# EasyEDA Pro project ESP32-C3-PICO开发板.eprj, board PCB1_10
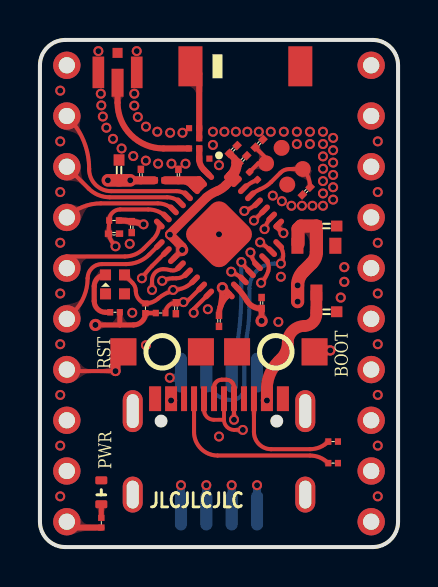
[diagram p6: board, top side]
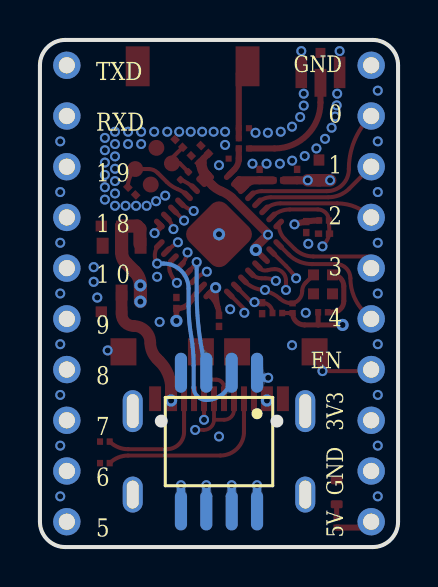
[diagram p7: board, bottom side, seen from below]

Outline 17.93 x 25.4 mm; copper layers: Top Layer, Inner1, Inner2, Bottom Layer. Coordinates in mm from the lower left corner of the outline.
Outline path: 0,24.13 0,1.27 arc(0.37,0.37) 1.27,0 16.66,0 arc(17.56,0.37) 17.93,1.27 17.93,24.13 arc(17.56,25.03) 16.66,25.4 1.27,25.4 arc(0.37,25.03) 0,24.13
Stack: Top Layer 0.035mm 外层铜厚1oz / Dielectric1 0.28mm 7628 RC49% 8.6mil / Inner1 0.035mm 内层铜厚 / Dielectric2 0.28mm 1.1mm H/HOZ 含铜 / Inner2 0.035mm 内层铜厚 / Dielectric3 0.28mm 7628 RC49% 8.6mil / Bottom Layer 0.035mm 外层铜厚1oz

## Design rules (mm)
template: 自定义配置
spacing copperThickness1oz (default): track to track 0.102, other pairs 0.152 to 0.3
spacing copperThickness2oz: track to track 0.203, other pairs 0.152 to 0.3
track width copperThickness1oz (default): min 0.127, default 0.254, max 2.54
track width copperThickness2oz: min 0.203, default 0.254, max 2.54
differential pair differentialPair (default): width min 0.127, default 0.254, max 2.54; gap min 0.152, default 0.152
via viaSize (default): diameter min 0.5, default 0.61, max 10; hole min 0.3, default 0.305, max 6.299
pour e54 uses 顶层铺铜

## Placement (name value [footprint] x y rotation side)
ANT1  CrossAir CA-C03  [ant-smd_ca-c03]  10.29 24.08 0 top
C1  15pF  [C0201]  13.34 17.83 45 top
C2  15pF  [C0201]  10.97 20.22 45 top
C6  100nF  [C0201]  6.93 18.64 90 top
C8  100nF  [C0201]  5.05 18.64 90 top
C9  100nF  [C0201]  8.97 11.33 90 top
C11  100nF  [C0201]  4.6 16.03 270 top
C15  1uF  [C0402MINI]  14.35 16.08 180 top
C16  1uF  [C0402MINI]  14.35 11.79 180 top
C21  1uF  [C0201]  11.1 12.22 90 top
C22  10uF  [C0402MINI]  3.96 18.88 270 top
C24  100nF  [C0201]  6.81 11.96 90 top
C28  1uF  [C0201]  9.68 19.91 225 top
C29  10nF  [C0201]  10.16 19.41 45 top
C30  100nF  [C0201]  3.71 15.7 0 top
H7  X6511WV-10H-C30D60  [HDR-TH_10P-P2.54-V-M]  1.35 12.7 90 top
H8  X6511WV-10H-C30D60  [HDR-TH_10P-P2.54-V-M]  16.59 12.7 90 top
L1  3nH  [l0201]  7.72 20.98 180 top
L2  24nH  [l0201#2]  10.69 18.59 135 top
L3  2nH  [l0201-rd]  5.99 18.37 0 top
LED1  NCD0402R1  [LED0402MINI]  3.07 2.74 270 top
LED6  SK6805-EC15  [led-smd_4p-l1.5-w1.5-bl]  3.76 13.16 180 top
R2  NC  [r0201]  7.72 19.96 180 top
R3  10kΩ  [R0201]  5.28 11.96 270 top
R4  5.1kΩ  [R0201]  14.68 4.2 180 top
R5  5.1kΩ  [R0201]  14.68 5.28 180 top
R7  10kΩ  [R0201]  3.71 16.36 0 top
R8  5.1kΩ  [R0201]  3.07 1.22 270 top
R11  NC  [r0201]  8.23 19.46 0 top
R12  0Ω  [r0201]  7.98 20.22 90 top
R13  0Ω  [R0201]  3.76 11.76 0 top
R14  10kΩ  [R0201]  6.05 11.72 180 top
RF1  KH-IPEX4-2020  [ipex4-smd_4p-l1.8-w1.7-ls2.0-l_kh-ipex4-2020]  3.89 24 90 top
SW1  TS-1185-C-B-B-A  [sw-smd_l4.0-w2.9-ls5.0]  6.12 9.78 0 top
SW2  TS-1185-C-B-B-A  [sw-smd_l4.0-w2.9-ls5.0]  11.81 9.78 180 top
U1  ESP32-C3FH4  [QFN-32_L5.0-W5.0-P0.50-TL-EP3.7]  8.97 15.67 315 top
U2  ME6211A33M3G-N  [sot-23-3_l2.9-w1.6-p1.90-ls2.8-br]  13.84 13.92 90 top
U4  GT-USB-7010ASV  [usb-c-smd_g-switch_gt-usb-7010asv]  8.97 5.03 0 top
U5  GD25Q128ESIGR  [SOP-8_L5.3-W5.3-P1.27-LS8.0-BL]  8.97 5.28 0 bottom
X1  40MHz  [crystal-smd_4p-l2.0-w1.6-bl]  12.24 19.08 315 top

## Footprints (pads in the part's own frame, mm; a bottom-side part is the same pattern mirrored in y, then rotated)
ant-smd_ca-c03
  rect 1.2x2 smd: 1(-2.75,0) 2(2.75,0)
C0201
  rect 0.368x0.324 smd: 1(-0.275,0) 2(0.275,0)
C0402MINI
  rect 0.567x0.54 smd: 1(-0.508,0) 2(0.508,0)
crystal-smd_4p-l2.0-w1.6-bl
  rrect 0.8x0.8 smd: 1(-0.75,-0.55) 2(0.75,-0.55) 3(0.75,0.55) 4(-0.75,0.55)
HDR-TH_10P-P2.54-V-M
  round 1.371 hole 0.813: 1(-11.43,0) 2(-8.89,0) 3(-6.35,0) 4(-3.81,0) 5(-1.27,0) 6(1.27,0) 7(3.81,0) 8(6.35,0) 9(8.89,0) 10(11.43,0)
ipex4-smd_4p-l1.8-w1.7-ls2.0-l_kh-ipex4-2020
  rect 1.4x0.6 smd: 1(-0.748,0)
  rect 1.58x0.58 smd: 2(-0.228,-0.96) 4(-0.228,0.96)
  rect 0.5x0.5 smd: 3(0.748,0)
l0201
  rect 0.305x0.305 smd: 1(-0.254,0) 2(0.254,0)
l0201#2
  rrect 0.305x0.324 smd: 1(-0.275,0) 2(0.275,0)
l0201-rd
  rect 0.368x0.324 smd: 1(-0.275,0) 2(0.275,0)
LED0402MINI
  rrect 0.4x0.6 smd: 1(-0.6,0) 2(0.6,0)
led-smd_4p-l1.5-w1.5-bl
  rect 0.55x0.55 smd: 1(-0.475,-0.475) 2(0.475,-0.475) 3(0.475,0.475) 4(-0.475,0.475)
QFN-32_L5.0-W5.0-P0.50-TL-EP3.7
  rrect 0.65x0.28 smd: 1(-2.478,1.75) 2(-2.478,1.25) 3(-2.478,0.75) 4(-2.478,0.25) 5(-2.478,-0.25) 6(-2.478,-0.75) 7(-2.478,-1.25) 8(-2.478,-1.75) 17(2.478,-1.75) 18(2.478,-1.25) 19(2.478,-0.75) 20(2.478,-0.25) 21(2.478,0.25) 22(2.478,0.75) 23(2.478,1.25) 24(2.478,1.75)
  rrect 0.28x0.65 smd: 9(-1.75,-2.478) 10(-1.25,-2.478) 11(-0.75,-2.478) 12(-0.25,-2.478) 13(0.25,-2.478) 14(0.75,-2.478) 15(1.25,-2.478) 16(1.75,-2.478) 25(1.75,2.478) 26(1.25,2.478) 27(0.75,2.478) 28(0.25,2.478) 29(-0.25,2.478) 30(-0.75,2.478) 31(-1.25,2.478) 32(-1.75,2.478)
  rrect 2.642x2.642 smd: 33(0,0)
r0201
  rect 0.305x0.305 smd: 1(-0.254,0) 2(0.254,0)
R0201
  rect 0.303x0.324 smd: 1(-0.241,0) 2(0.241,0)
SOP-8_L5.3-W5.3-P1.27-LS8.0-BL
  oval 0.609x2 smd: 1(-1.905,-3.45) 2(-0.635,-3.45) 3(0.635,-3.45) 4(1.905,-3.45) 5(1.905,3.45) 6(0.635,3.45) 7(-0.635,3.45) 8(-1.905,3.45)
sot-23-3_l2.9-w1.6-p1.90-ls2.8-br
  rect 0.8x0.6 smd: 1(1.172,-0.95) 2(1.171,0.95) 3(-1.171,0)
sw-smd_l4.0-w2.9-ls5.0
  rect 1.3x1.36 smd: 1(-1.94,0) 2(1.94,0)
usb-c-smd_g-switch_gt-usb-7010asv
  oval 1x2.1 hole 0.6x1.7: 1(-4.32,1.78) 2(4.32,1.78)
  oval 1x1.8 hole 0.6x1.4: 3(4.32,-2.4) 4(-4.32,-2.4)
  rect 0.6x1.24 smd: A1B12(-3.2,2.4) A4B9(-2.4,2.4) B1A12(3.2,2.4) B4A9(2.4,2.4)
  rect 0.3x1.24 smd: A5(-1.25,2.4) A6(-0.25,2.4) A7(0.25,2.4) A8(1.25,2.4) B5(1.75,2.4) B6(0.75,2.4) B7(-0.75,2.4) B8(-1.75,2.4)

## Nets
As in the schematic.

Pads without a net: ANT1 2; LED6 3; U4 A8 B8

## Via types
v1: diameter 0.559, hole 0.305, Top Layer to Bottom Layer, 1 via
v2: diameter 0.5, hole 0.299, Top Layer to Bottom Layer, 97 vias
v3: diameter 0.61, hole 0.305, Top Layer to Bottom Layer, 8 vias
v4: diameter 0.5, hole 0.3, Top Layer to Bottom Layer, 8 vias
v5: diameter 0.508, hole 0.299, Top Layer to Bottom Layer, 3 vias

## Routing (per net, layer and track width the routed paths; a pad name or vN(x,y) marks a point on that pad's centre or on a via; arc(x,y) is an arc through that point)
GND:
  vias: v2(1.02,22.86) v2(1.02,20.32) v2(1.02,17.78) v2(1.02,15.24) v2(1.02,12.7) v2(1.02,10.16) v2(1.02,7.62) v2(1.02,5.08) v2(1.02,2.54) v2(2.93,24.84) v2(3.05,22.71) v2(3.07,22.12) v2(3.15,21.56) v2(3.33,21) v2(3.66,20.45) v2(4.09,19.96) v2(4.5,15.19) v2(4.67,19.58) v2(4.62,11.73) v2(4.72,22.71) v2(4.72,22.11) v2(4.85,24.84) v2(4.9,21.54) v2(5.31,21.06) v2(5.3,19.35) v2(5.31,10.11) v2(5.88,20.8) v2(6.52,20.75) v2(6.58,19.2) v2(7.14,20.75) v2(7.29,19.2) v2(8.41,11.91) v2(8.66,20.14) v2(8.97,19.13) v2(8.97,5.54) v2(9.24,20.8) v2(10.38,20.8) v2(10.96,20.8) v2(11.56,20.8) v2(11.66,17.6) v2(11.94,11.28) v2(12.06,13.54) v2(12.21,20.8) v2(12.59,17.09) v2(12.87,20.8) v2(12.87,20.19) v2(13.12,17.09) v2(13.52,20.8) v2(13.52,20.19) v2(13.65,17.09) v2(14.17,20.8) v2(14.17,20.18) v2(14.17,19.57) v2(14.17,18.95) v2(14.17,18.33) v2(14.17,17.71) v2(14.17,17.09) v2(14.68,20.49) v2(14.68,19.88) v2(14.68,19.26) v2(14.68,18.64) v2(14.68,18.02) v2(14.68,17.4) v2(16.92,20.32) v2(16.92,17.78) v2(16.92,15.24) v2(16.92,12.7) v2(16.92,10.16) v2(16.92,7.62) v2(16.92,5.08) v2(16.92,2.54) v3(8.97,15.67) v4(5.92,19.2) v4(8.66,20.8) v4(9.81,20.8) v4(12.12,17.32) v5(15.06,12.5) v5(15.24,14.02) v5(15.24,13.28)
VBUS: length 23.4
  Top Layer w0.302: 1.35,1.27 1.64,0.98 R8.2
  Top Layer w0.584: 11.37,7.33 11.37,7.92 arc(11.51,8.66) 11.94,9.3 12.08,9.43 arc(12.32,9.8) 12.41,10.24 arc(12.65,10.83) 13.25,11.07 arc(13.67,11.25) 13.84,11.67 C16.2 U2.3
  Inner1 w1.016: 7.39,7.34 v3(11.37,7.34) ; 7.39,7.34 v3(6.57,7.34) ; 7.39,7.34 7.39,5.82 arc(7.04,4.99) 6.21,4.64 4.44,4.64 arc(3.55,4.27) 3.18,3.38 arc(2.65,1.98) 1.35,1.27
VDD_3V3: length 56.8
  Top Layer w0.203: R3.2 arc(5.54,11.72) R14.2
  Top Layer w0.254: R13.2 4,11.12 ; 4,11.12 4.69,11.12 arc(5.11,11.3) R3.2 ; 4,11.12 v3(2.78,11.12)
  Top Layer w0.28: 9.73,19.48 9.73,19.25 arc(9.66,18.93) U1.32 ; U1.11 v3(7.12,14.88) ; U1.32 9.91,19.08 ; U1.32 9.68,18.66 ; 9.91,19.08 9.96,19.14 ; 9.91,19.08 arc(9.76,18.89) 9.68,18.66 ; 9.68,18.66 9.73,18.66 9.78,18.61 ; 9.96,19.14 9.97,19.14 C29.1 arc(9.97,19.17) 9.96,19.14 ; 9.96,19.14 arc(9.9,18.86) 9.78,18.61 ; 9.78,18.61 9.95,18.44 ; 9.04,12.04 arc(8.98,11.82) C9.2 ; 9.04,12.04 arc(9.17,12.32) 9.36,12.56 U1.17 v1(9.13,12.99) arc(9.11,12.51) 9.04,12.04
  Top Layer w0.305: R7.2 arc(4.28,16.34) 4.6,16.31 arc(4.9,16.25) v2(5.19,16.16)
  Top Layer w0.33: C29.1 9.97,19.24 9.73,19.48 C28.2
  Top Layer w0.406: v2(4.52,18.37) C8.1 L3.1
  Top Layer w0.457: 9.66,18.48 9.3,18.12 arc(9.09,17.95) 8.86,17.83 arc(8.58,17.69) 8.33,17.51 6.51,15.68 v2(6.51,15.65) 7.12,15.03 v3(7.12,14.88)
  Top Layer w0.635: v2(3.4,18.37) C22.2 v2(4.52,18.37)
  Top Layer w0.66: 12.92,15.18 12.92,15.94 13.07,16.08 C15.2 13.84,14.78 arc(13.78,14.48) 13.61,14.22 13.19,13.8 arc(12.98,13.48) v3(12.9,13.11) v3(12.9,12.29)
  Inner1 w1.016: 2.78,17.39 2.78,17.74 arc(2.96,18.19) v2(3.4,18.37) v2(4.52,18.37) ; 2.78,17.39 2.78,14.93 ; 2.78,17.39 arc(3.14,16.52) 4.01,16.16 ; 2.78,14.93 v3(2.78,11.12) 2.78,7.78 1.35,6.35 ; 2.78,14.93 arc(3.14,15.8) 4.01,16.16 ; 11.44,12.3 v3(12.9,12.29) v3(12.9,13.11) arc(12.28,12.51) 11.44,12.3 ; 11.44,12.3 arc(10.62,12.38) 9.84,12.62 arc(9.48,12.79) v1(9.13,12.99) arc(8.79,13.24) 8.48,13.53 v3(7.12,14.88) 6.3,15.7 arc(5.79,16.04) v2(5.19,16.16) 4.01,16.16
VDD_SPI: length 20.6
  Top Layer w0.28: v3(11.1,11.33) C21.1 arc(10.68,12.04) 10.36,12.34 arc(10.12,12.7) 9.83,13.03
  Inner2 w0.406: v2(7.06,3.1) arc(8.02,2.46) 9.15,2.23 10.87,2.23 arc(11.48,2.49) 11.73,3.1 arc(11.48,3.71) 10.87,3.96 arc(10.39,4.01) 9.93,4.17 arc(9.46,4.34) 8.97,4.44 arc(8.46,4.72) 8.25,5.26 8.25,6.75 arc(8.41,7.51) 8.84,8.15 10.45,9.77 arc(10.93,10.48) v3(11.1,11.33)
  Bottom Layer w0.406: v2(7.06,3.1) U5.8
CHIP_EN: length 14.5
  Top Layer w0.203: H7.4 1.42,8.81 v4(3.78,8.81) ; v4(3.78,15.06) arc(3.56,15.35) C30.1 R7.1 arc(3.63,16.75) 4.02,16.91 5.42,16.91 arc(5.91,16.81) U1.7
  Top Layer w0.5: v4(3.78,8.81) 3.78,9.38 SW1.1
  Inner1 w0.254: 3.68,15.06 3.68,8.81
GPIO0: length 8.6
  Top Layer w0.203: H7.9 1.39,21.55 arc(2.18,20.36) 2.46,18.95 2.46,18.92 arc(2.78,18.15) 3.56,17.83 6.83,17.83 arc(7.13,17.77) U1.4
GPIO1: length 6.3
  Top Layer w0.203: H7.8 2.44,17.96 arc(2.92,17.63) 3.49,17.52 6.37,17.52 arc(6.73,17.45) U1.5
GPIO2: length 5.6
  Top Layer w0.203: 1.35,16.51 arc(2.13,17.03) 3.05,17.21 5.89,17.21 arc(6.32,17.13) U1.6
GPIO3: length 6
  Top Layer w0.203: H7.6 1.35,14.55 4.24,14.55 arc(4.76,14.66) 5.19,14.95 5.66,15.41 arc(5.89,15.76) U1.8
GPIO4: length 6.7
  Top Layer w0.203: U1.9 5.48,14.65 arc(4.95,14.3) 4.32,14.17 3.1,14.17 arc(2.6,13.96) 2.39,13.46 arc(2.21,12.55) 1.69,11.77 1.35,11.43
GPIO5: length 21.7
  Top Layer w0.203: 6.33,14.8 5.62,14.08 arc(5.35,13.78) v2(5.11,13.46)
  Inner1 w0.203: v2(5.11,13.46) 5.11,12.7 arc(6.38,9.61) 9.47,8.33 13.08,8.33 arc(14.57,7.71) 15.19,6.22 arc(15.22,5.6) 15.32,4.98 arc(15.41,4.4) 15.44,3.82 arc(15.74,2.43) 16.59,1.27
GPIO6: length 18.9
  Top Layer w0.203: v2(5.61,12.88) 5.61,13.36 arc(5.78,13.76) 6.17,13.92 arc(6.35,13.91) 6.53,13.87 arc(6.82,13.89) U1.12
  Inner1 w0.203: H8.2 16.43,3.97 arc(15.74,5) 15.49,6.22 arc(14.79,7.93) 13.08,8.64 9.5,8.64 arc(6.75,9.77) 5.61,12.52 v2(5.61,12.88)
GPIO7: length 15.9
  Top Layer w0.203: U1.13 7.32,13.66 arc(7.09,13.51) 6.83,13.46 6.65,13.46 arc(6.38,13.43) v2(6.12,13.33)
  Inner1 w0.203: 16.59,6.35 16.59,6.55 15.12,8.02 arc(14.2,8.7) 13.08,8.94 9.5,8.94 arc(7.11,9.93) 6.12,12.32 v2(6.12,13.33)
GPIO8: length 17.1
  Top Layer w0.203: LED6.1 4.63,13.23 arc(4.76,13.05) 4.8,12.83 arc(4.94,12.43) R3.1 arc(5.62,12.27) 5.92,12.45 arc(6.27,12.68) 6.67,12.83 ; v2(6.67,12.88) arc(7.26,13.01) U1.14
  Inner1 w0.203: 6.67,12.83 6.67,12.08 arc(7.5,10.08) 9.5,9.25 16.23,9.25 H8.4
GPIO9/BOOT: length 15.1
  Top Layer w0.203: v2(7.19,12.27) 7.34,12.27 8.1,13.03 ; R14.1 arc(6.44,12.09) 6.8,12.24
  Top Layer w0.305: v2(7.19,12.27) C24.2
  Top Layer w0.5: v2(14.54,9.85) 13.82,9.85 SW2.1
  Inner1 w0.203: 16.59,11.43 16.12,11.43 v2(14.54,9.85) arc(14.21,9.63) 13.82,9.55 9.49,9.55 arc(7.86,10.22) 7.19,11.85 v2(7.19,12.27)
GPIO10: length 13.4
  Top Layer w0.203: U1.16 7.7,11.92 v2(7.7,11.73)
  Inner1 w0.203: H8.6 arc(15.63,12.12) 14.4,10.44 arc(13.83,10.01) 13.13,9.85 9.58,9.85 arc(8.25,10.41) v2(7.7,11.73)
GPIO18/USB_DN: length 22.5
  Top Layer w0.191: U4.B7 8.22,6.86 arc(8.36,6.52) 8.7,6.38 9.22,6.38 ; 9.22,6.38 U4.A7 ; 9.22,6.38 arc(9.36,6.02) 9.72,5.87 v2(10.16,5.87)
  Top Layer w0.28: v2(12.19,15.72) 11.84,16.07 U1.25
  Inner1 w0.203: 16.59,16.51 15.75,15.67 arc(15.27,15.35) 14.71,15.24 13.36,15.24 arc(12.73,15.37) v2(12.19,15.72)
  Inner2 w0.203: v2(12.19,15.72) 13.44,14.48 arc(13.87,13.83) 14.02,13.07 14.02,10.45 arc(13.37,8.87) 11.79,8.21 11.75,8.21 arc(10.71,7.79) 10.29,6.76 10.29,5.99 v2(10.16,5.87)
GPIO19/USB_DP: length 24.9
  Top Layer w0.203: U4.A6 8.72,8 arc(8.83,8.27) 9.1,8.38 9.34,8.38 arc(9.6,8.27) 9.72,8 U4.B6 v2(9.72,6.38) ; U1.26 arc(11.38,16.25) v2(11.25,15.92)
  Inner1 w0.203: H8.8 16.38,18.85 arc(15.71,17.83) 15.47,16.64 arc(15.17,15.92) 14.45,15.62 13.54,15.62 arc(13.12,15.73) 12.78,16 arc(12.62,16.14) 12.42,16.23 arc(11.79,16.24) v2(11.25,15.92)
  Inner2 w0.203: v2(11.25,15.92) 13.22,13.95 arc(13.59,13.4) 13.72,12.75 13.72,10.52 arc(13.14,9.11) 11.73,8.53 arc(11.08,8.4) 10.52,8.03 10.32,7.83 arc(9.87,7.16) v2(9.72,6.38)
GPIO20/U0RXD: length 11
  Top Layer w0.203: v4(10.72,16.35) U1.27
  Inner2 w0.203: v4(10.72,16.35) 10.79,16.43 11.2,16.43 arc(11.82,16.37) 12.42,16.18 arc(12.96,15.98) 13.52,15.9 14.1,15.9 arc(15.12,16.32) 15.54,17.35 15.54,19.08 arc(15.82,20.44) H8.9
GPIO21/U0TXD: length 13.6
  Top Layer w0.203: U1.28 arc(10.59,17) v4(10.23,16.83)
  Inner2 w0.203: v4(10.23,16.83) 10.27,16.87 10.74,16.87 arc(11.67,16.77) 12.55,16.48 arc(13.04,16.29) 13.56,16.2 13.97,16.2 arc(14.87,16.58) 15.24,17.47 15.24,19.35 arc(15.28,19.82) 15.39,20.27 arc(15.51,20.81) 15.54,21.36 15.54,21.62 arc(15.82,22.98) H8.10
SPICLK: length 15.3
  Top Layer w0.203: v2(11.07,13.23) arc(11.29,13.5) 11.43,13.82 arc(11.43,14.16) U1.22
  Inner2 w0.203: v2(11.07,13.23) 10.62,12.78 arc(10.32,12.33) 10.21,11.78 10.21,11.16 arc(10.1,10.61) 9.79,10.15 8.05,8.41 arc(7.59,7.72) 7.43,6.91 7.43,5 arc(7.71,4.15) 8.43,3.63 arc(9.03,3.4) v2(9.6,3.1)
  Bottom Layer w0.406: v2(9.6,3.1) U5.6
SPICS0: length 11
  Top Layer w0.203: U1.21 arc(10.67,14.4) v2(10.54,14.76)
  Inner2 w0.203: v2(6.5,8.48) arc(7.59,9.01) 8.54,9.76 9.24,10.46 arc(9.51,10.86) 9.6,11.33 arc(9.53,11.68) 9.33,11.98 8.76,12.55 arc(8.59,12.8) 8.53,13.1 arc(8.61,13.46) 8.81,13.76 9.63,14.58 arc(10.06,14.81) v2(10.54,14.76)
  Bottom Layer w0.406: v2(6.5,8.48) 7.06,8.48 U5.1
SPID: length 17.8
  Top Layer w0.203: 11.6,14.8 arc(11.32,15.05) v2(11.02,15.27)
  Inner2 w0.203: v2(11.02,15.27) 11.15,15.27 11.15,14.28 arc(11.2,14.02) 11.35,13.8 arc(11.52,13.54) 11.58,13.23 arc(11.54,13) 11.4,12.8 10.83,12.23 arc(10.6,11.88) 10.52,11.46 10.52,11.11 arc(10.39,10.49) 10.04,9.97 8.35,8.27 arc(7.89,7.6) 7.73,6.8 7.73,5.05 arc(8,4.35) 8.66,3.99 arc(9.82,3.68) v2(10.87,3.1)
  Bottom Layer w0.406: v2(10.87,3.1) U5.5
SPIHD: length 14.3
  Top Layer w0.203: U1.19 arc(9.9,13.62) v2(9.58,13.79)
  Inner2 w0.203: v2(8.33,3.1) arc(7.46,3.79) 7.12,4.85 7.12,6.95 arc(7.3,7.84) 7.81,8.6 9.53,10.32 arc(9.81,10.74) 9.91,11.23 9.91,12.82 arc(9.83,13.34) v2(9.58,13.79)
  Bottom Layer w0.406: v2(8.33,3.1) U5.7
SPIQ: length 11.4
  Top Layer w0.203: U1.24 arc(12.18,14.69) v2(12.06,14.2)
  Bottom Layer w0.203: v2(12.06,14.2) 11.73,14.2 arc(10.85,13.83) 10.49,12.95 10.49,12.06 arc(10.46,11.33) 10.36,10.59 arc(10.27,9.84) 10.24,9.09 10.24,8 arc(10.05,7.55) 9.6,7.37 arc(8.7,7.74) 8.33,8.64 U5.2
SPIWP: length 6.2
  Top Layer w0.203: U1.20 arc(10.3,14) v2(10.08,14.27)
  Bottom Layer w0.203: v2(10.08,14.27) 10.08,12.71 arc(9.96,10.76) 9.6,8.84
USB_CC1: length 9.2
  Top Layer w0.203: U4.A5 7.72,5.77 arc(8.06,4.93) 8.9,4.58 13.52,4.58 arc(14.02,4.49) R4.2
USB_CC2: length 6
  Top Layer w0.203: 10.72,7.4 10.72,5.77 arc(10.97,5.15) 11.58,4.9 13.52,4.9 arc(14.02,5) R5.2
$1N537: length 4.1
  Top Layer w0.203: U1.29 arc(10.78,17.79) 11.05,17.93 arc(11.33,18.08) 11.58,18.29 12.04,18.74 arc(12.25,18.88) 12.5,18.93 X1.3 arc(13.43,18.51) C1.2
$1N9429: length 0.7
  Top Layer w0.254: LED1.2 R8.1
$1N59078: length 2
  Top Layer w0.203: L2.2 10.93,19.22 X1.1 11.32,19.48 10.78,20.02
$1N59083: length 0.8
  Top Layer w0.203: U1.30 arc(10.51,18.21) 10.89,18.4
$1N70790: length 5.9
  Top Layer w0.305: RF1.1 3.89,22.26 arc(4.56,20.64) 6.18,19.96 R2.2
$1N70798: length 1.5
  Top Layer w0.305: U1.1 8.2,18.9 arc(8.03,19.16) R11.1 ; 7.98,19.46 R2.1
$1N70816: length 3.8
  Top Layer w0.305: R12.2 L1.1 7.98,23.72 7.61,24.08
$1N70868: length 3.1
  Top Layer w0.28: U1.3 7.6,18.09 arc(7.29,18.3) C6.1 ; U1.2 8.06,18.27
  Top Layer w0.406: 8.06,18.27 7.96,18.37 C6.1 L3.2
  Top Layer w0.533: 8.04,18.19 7.86,18.01
$1N74389: length 2.8
  Top Layer w0.254: R13.1 3.28,11.76 arc(2.88,11.92) 2.72,12.32 2.72,13.07 arc(2.88,13.47) LED6.2

## Copper pours and planes (outline as drawn; the poured copper is in the pictures)
GND on Top Layer: -3.73,26.62 19.13,26.62 19.13,-1.32 -3.73,-1.32
GND on Bottom Layer: -1.19,26.62 21.67,26.62 21.67,-1.32 -1.19,-1.32
GND on Inner1: -1.19,29.16 19.13,29.16 19.13,-1.32 -1.19,-1.32
GND on Inner2: -1.19,26.62 19.13,26.62 19.13,-3.86 -1.19,-3.86

Small or netless copper shapes (teardrops, artwork), in the pictures only: 129 on Top Layer, 14 on Bottom Layer, 24 on Inner1, 18 on Inner2

## Text on the board
Bottom Silkscreen Layer: 3V3 | GND | 5V | EN | TXD | RXD | 1 9 | 1 8 | 1 0 | 9 | 8 | 7 | 6 | 5 | 0 | 1 | 2 | 3 | 4
Top Silkscreen Layer: JLCJLCJLC | RST | PWR | BOOT
